# EAGLE design pwm_power_supply_v1.2 (EAGLE 5.10)
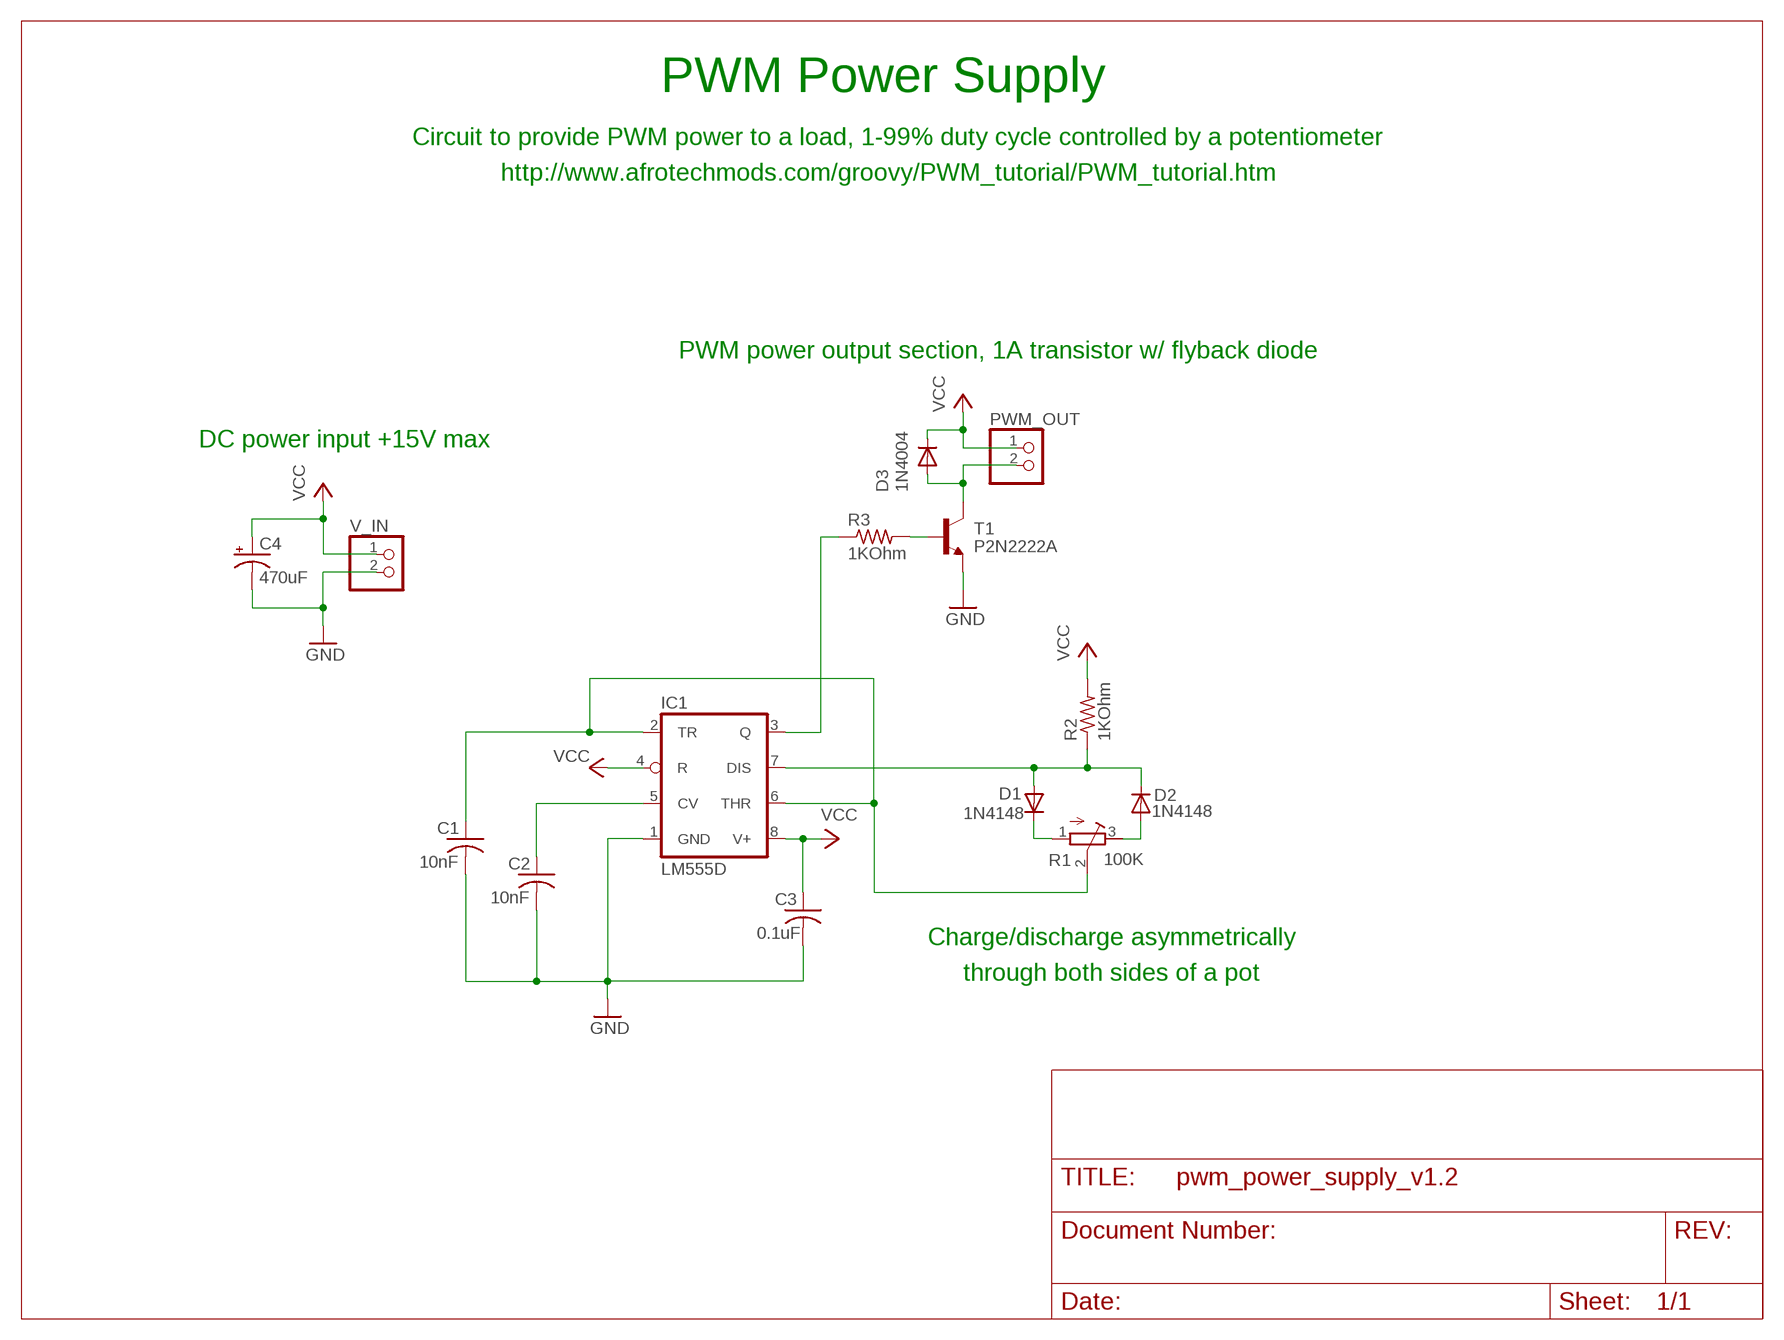
[diagram p0: schematic, sheet 1]

## Parts
C1  10nF  C-US025-025X050  [C025-025X050]
C2  10nF  C-US025-025X050  [C025-025X050]
C3  0.1uF  C-US025-025X050  [C025-025X050]
C4  470uF  CPOL-USE2.5-7  [E2,5-7]
D1  1N4148  [DO35-10]
D2  1N4148  [DO35-10]
D3  1N4004  [DO41-10]
IC1  LM555D  [SO08]
PWM_OUT  PINHD-1X2  [1X02]
R1  100K  R-TRIMM64W  [RTRIM64W]
R2  1KOhm  R-US_0204/7  [0204/7]
R3  1KOhm  R-US_0204/7  [0204/7]
T1  P2N2222A  MPS2222A-NPN-TO92-CBE  [TO92-CBE]
V_IN  PINHD-1X2  [1X02]

## Nets
GND: C1.2 C2.2 C3.2 C4.- IC1.1(GND) T1.E V_IN.2
N$1: C1.1 IC1.2(TR) IC1.6(THR) R1.2(S)
N$3: D1.A D2.C IC1.7(DIS) R2.1
N$4: D1.C R1.1(E)
N$5: D2.A R1.3(A)
N$6: C2.1 IC1.5(CV)
N$7: R3.2 T1.B
N$9: IC1.3(Q) R3.1
N$10: D3.A PWM_OUT.2 T1.C
VCC: C3.1 C4.+ D3.C IC1.4(R) IC1.8(V+) PWM_OUT.1 R2.2 V_IN.1

## Notes on the sheet
- PWM Power Supply
- Circuit to provide PWM power to a load, 1-99% duty cycle controlled by a potentiometer
- http://www.afrotechmods.com/groovy/PWM_tutorial/PWM_tutorial.htm
- PWM power output section, 1A transistor w/ flyback diode
- DC power input +15V max
- Charge/discharge asymmetrically
- through both sides of a pot

## Library data of the parts
C1-C3 = rcl:C-US: CAPACITOR, American symbol
C4 = rcl:CPOL-US: POLARIZED CAPACITOR, American symbol
D1 D2 = diode:1N4148: DIODE high speed (Philips)
D3 = diode:1N4004: DIODE general purpose rectifier, 1 A
IC1 = linear:*555: TIMER
PWM_OUT V_IN = pinhead:PINHD-1X2: PIN HEADER
R1 = rcl:R-TRIMM: Trimm resistor
R2 R3 = rcl:R-US_: RESISTOR, American symbol
T1 = transistor:*-NPN-: NPN Transistror BF959 corrected 2008.03.06

## Board
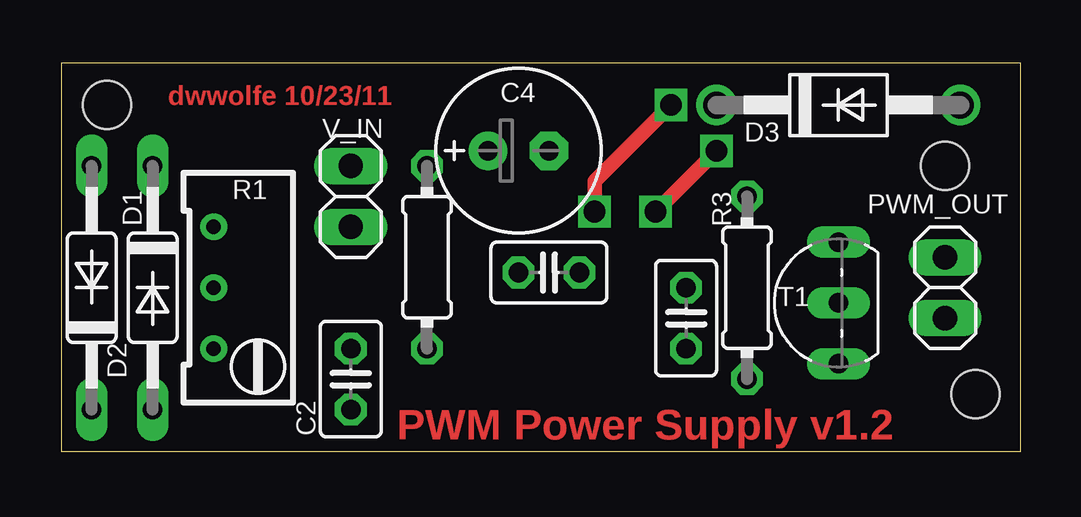
[diagram p1: board, top side]
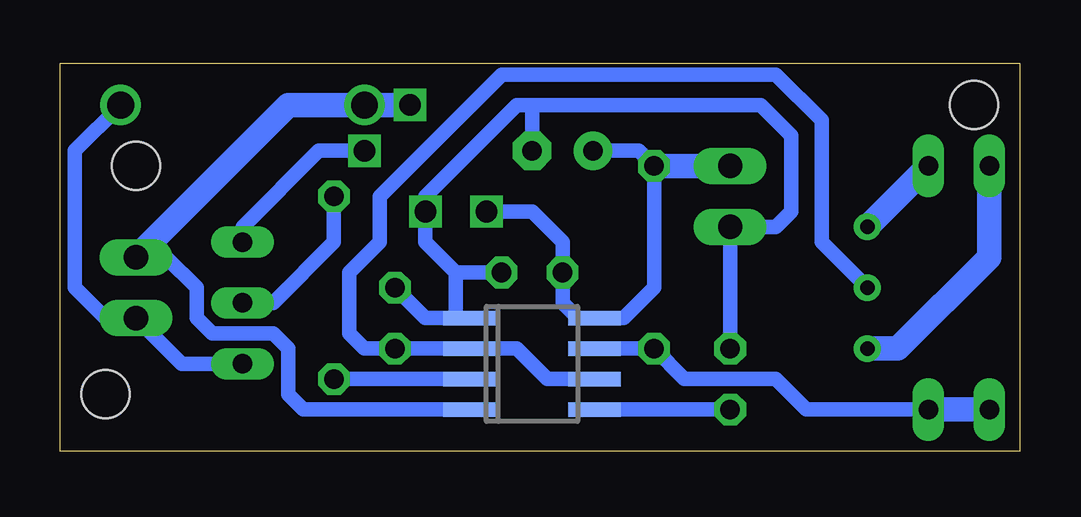
[diagram p2: board, bottom side, seen from below]

Size 39.98 x 16.18 mm. Coordinates in mm from the lower left corner, seen from the top.
Outline: 0,0 39.98,0 39.98,16.18 0,16.18 0,0
Copper layers (1*16): Top 0.035mm / dielectric 1.5mm / Bottom 0.035mm
Design rules "default": minimum track width 10mil, minimum drill 24mil, track to track 8mil, track to pad 8mil, pad to pad 8mil, via to via 8mil, smd to smd 8mil, copper to edge 40mil, drill to drill 8mil, minimum pad ring 10mil, minimum via ring 8mil, stop-mask expansion 4mil, vias tented up to drill 0mil, thermal gap 10mil
Holes 2 mm at 1.9,14.44 36.82,11.9 38.09,2.38

### Footprints (pad centres in the part's own frame; a part is rotated, then mirrored left to right if it is on the bottom)
C025-025X050 = drill 0.813 octagon: 1 -1.27,0; 2 1.27,0
E2,5-7 = drill 0.813 pad 1.6 round: + -1.27,0 | drill 0.813 pad 1.6 octagon: - 1.27,0
DO35-10 = drill 0.813 long: A 5.08,0; C -5.08,0
DO41-10 = drill 1.118 round: A 5.08,0; C -5.08,0
SO08 = smd 0.6 x 2.2: 1 -1.905,-2.6; 2 -0.635,-2.6; 3 0.635,-2.6; 4 1.905,-2.6; 5 1.905,2.6; 6 0.635,2.6; 7 -0.635,2.6; 8 -1.905,2.6
1X02 = drill 1.016 long: 1 -1.27,0; 2 1.27,0
RTRIM64W = drill 0.61 round: 1 1.27,-2.54; 2 1.27,0; 3 1.27,2.54
0204/7 = drill 0.813 octagon: 1 -3.81,0; 2 3.81,0
TO92-CBE = drill 0.813 long: B 0,0; C -2.54,0; E 2.54,0

### Placement (x,y rotation side)
C1  26.03,5.55 90 top
C2  12.06,3.01 90 top
C3  20.32,7.46 0 top
C4  19.05,12.54 0 top
D1  3.81,6.82 270 top
D2  1.27,6.82 90 top
D3  32.38,14.44 0 top
IC1  20.32,3.65 270 bottom
PWM_OUT  36.82,6.82 270 top
R1  7.62,6.82 180 top
R2  15.23,8.09 90 top
R3  28.57,6.82 90 top
T1  32.38,6.18 90 top
V_IN  12.06,10.63 270 top

### Tracks (layer width: path | path; a pad name or v marks a point on that pad's centre or on a via)
GND  (via drill 0.9)
  Top 0.61: v24.76,10 v27.3,12.54
  Bottom 0.61: 22.86,5.55 IC1.1 23.49,5.55 | T1.E 32.38,9.36 29.21,12.54 v27.3,12.54 | C1.2 24.76,5.55 23.49,5.55 | 23.49,7.46 23.49,5.55 | 23.49,7.46 C3.2 | C2.2 V_IN.2 10.15,9.36 9.52,10 9.52,13.17 10.79,14.44 20.32,14.44 | 20.32,14.44 20.95,14.44 24.76,10.63 v24.76,10 24.76,8.73 23.49,7.46 | 20.32,14.44 C4.-
N$1
  Bottom 0.61: IC1.2 22.86,4.28 | IC1.2 20.95,4.28 19.68,3.01 IC1.6 | IC1.2 C1.1 27.3,4.28 27.94,4.92 27.94,7.46 26.67,8.73 26.67,10.63 21.59,15.71 10.15,15.71 8.25,13.81 8.25,8.73 R1.2
N$3
  Bottom 0.61: IC1.7 R2.1 13.96,3.01 10.15,3.01 8.88,1.74 D1.A
  Bottom 1.016: D2.C D1.A
N$4
  Bottom 1.016: D1.C R1.1
N$5
  Bottom 1.016: D2.A 1.27,8.09 5.08,4.28 R1.3
N$6
  Bottom 0.61: 17.78,1.74 IC1.5 C2.1
N$7
  Bottom 0.61: R3.2 28.57,8.73 31.11,6.18 T1.B
N$9
  Bottom 0.61: 22.86,3.01 IC1.3 R3.1
N$10
  Bottom 0.61: T1.C 34.92,3.65 PWM_OUT.2 38.09,5.55 39.36,6.82 39.36,12.54 D3.A
VCC  (via drill 0.9)
  Top 0.61: v22.22,10 22.22,11.27 v25.39,14.44
  Bottom 0.61: 22.86,1.74 IC1.4 29.84,1.74 30.48,2.38 30.48,4.28 31.11,4.92 33.65,4.92 34.28,5.55 34.28,6.82 35.55,8.09 PWM_OUT.1 | IC1.8 17.78,5.55 | IC1.8 16.51,5.55 15.23,6.82 R2.2 15.87,12.54 C4.+ | IC1.8 18.41,5.55 19.05,6.18 C3.1 19.05,8.73 20.32,10 v22.22,10
  Bottom 1.016: PWM_OUT.1 30.48,14.44 D3.C v25.39,14.44 | V_IN.1 R2.2

### Text on the board
Top: dwwolfe 10/23/11 | PWM Power Supply v1.2